# Altium schematic sheet Autoreset.SchDoc
size A4; SheetNumber: 10; SheetTotal: 12
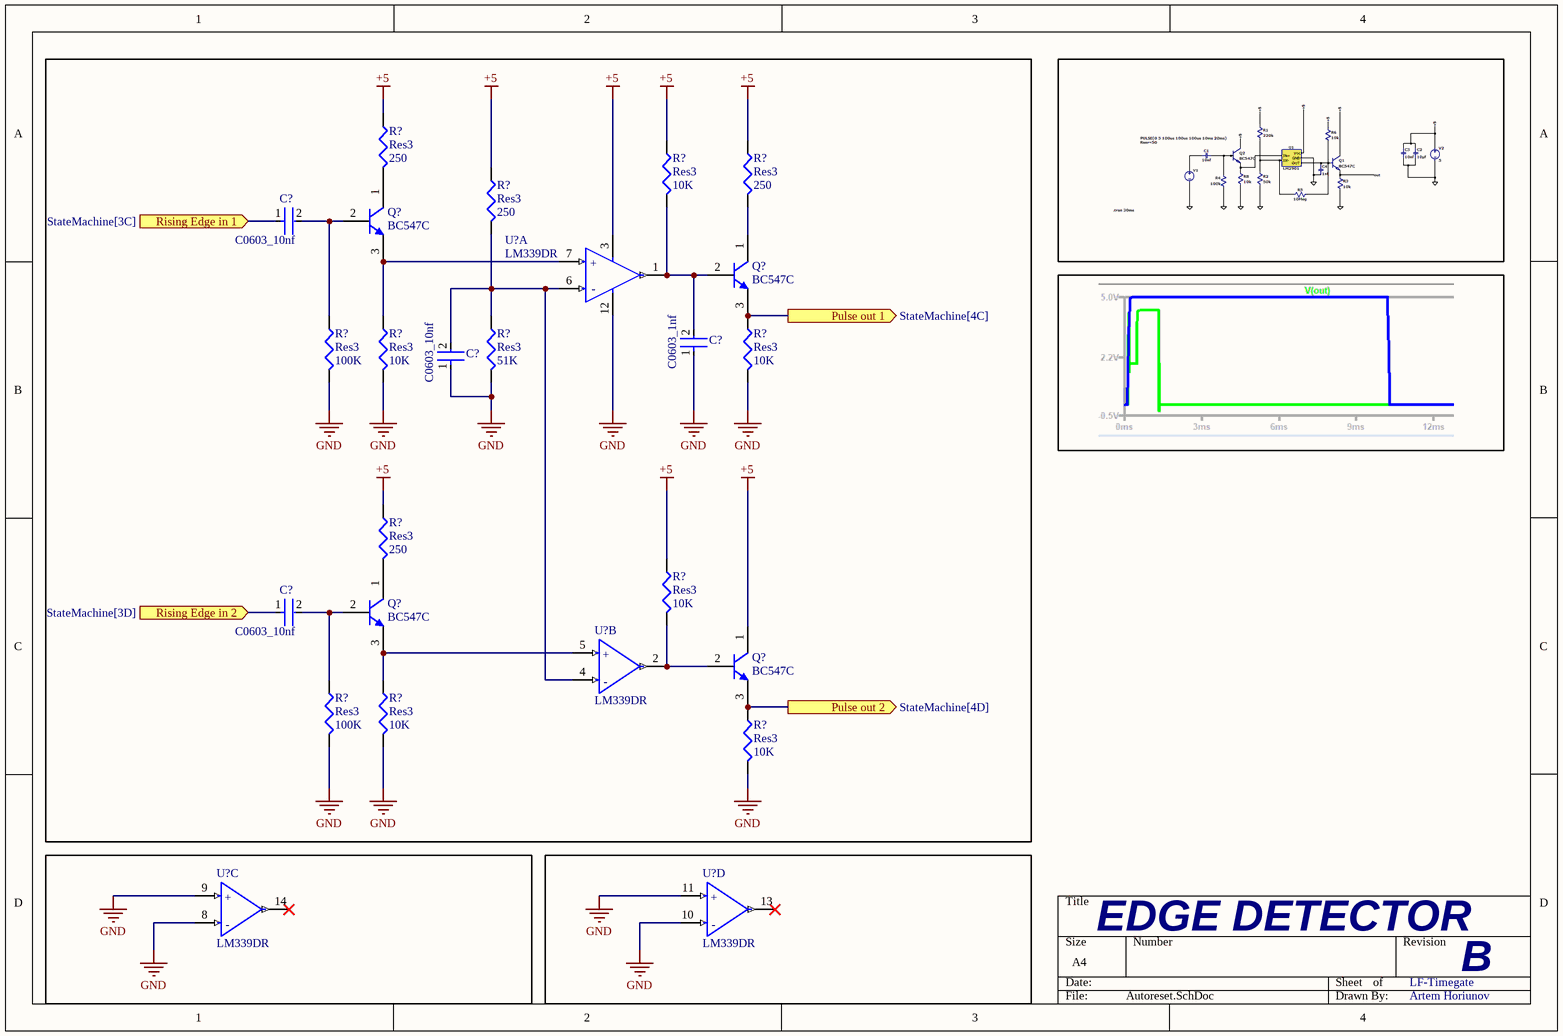
[diagram p0: Autoreset.SchDoc]

## Parts
(Parts that share a designator on the sheet are numbered #1, #2 ... from top to bottom, then left to right.)
C?#1  C0603_10nf  [FP-C0603C-CF-MFG]
C?#2  C0603_1nf  [FP-C0603C-CF-MFG]
C?#3  C0603_10nf  [FP-C0603C-CF-MFG]
C?#4  C0603_10nf  [FP-C0603C-CF-MFG]
Q?#1  BC547C  [ONSC-TO-92-3-29-11]
Q?#2  BC547C  [ONSC-TO-92-3-29-11]
Q?#3  BC547C  [ONSC-TO-92-3-29-11]
Q?#4  BC547C  [ONSC-TO-92-3-29-11]
R?#1  Res3  value 250  [J1-0603]
R?#2  Res3  value 10K  [J1-0603]
R?#3  Res3  value 250  [J1-0603]
R?#4  Res3  value 250  [J1-0603]
R?#5  Res3  value 100K  [J1-0603]
R?#6  Res3  value 10K  [J1-0603]
R?#7  Res3  value 51K  [J1-0603]
R?#8  Res3  value 10K  [J1-0603]
R?#9  Res3  value 250  [J1-0603]
R?#10  Res3  value 10K  [J1-0603]
R?#11  Res3  value 100K  [J1-0603]
R?#12  Res3  value 10K  [J1-0603]
R?#13  Res3  value 10K  [J1-0603]
U?#1  LM339DR  [FP-D0014A-MFG]  (part A of 4)
U?#2  LM339DR  [FP-D0014A-MFG]  (part B of 4)
U?#3  LM339DR  [FP-D0014A-MFG]  (part C of 4)
U?#4  LM339DR  [FP-D0014A-MFG]  (part D of 4)

## Ports
Pulse out 1 (out, see StateMachine[4C]), Pulse out 2 (out, see StateMachine[4D]), Rising Edge in 1 (in, see StateMachine[3C]), Rising Edge in 2 (in, see StateMachine[3D])

## Nets
+5: Q?#4.1(C) R?#1.1 R?#2.1 R?#3.1 R?#4.1 R?#9.1 R?#10.1 U?#1.3(VCC)
GND: C?#2.1 C?#3.1 R?#5.2 R?#6.2 R?#7.2 R?#8.2 R?#11.2 R?#12.2 R?#13.2 U?#1.12(GND) U?#3.8(3IN-) U?#3.9(3IN+) U?#4.10(4IN-) U?#4.11(4IN+)
Pulse out 1: Q?#2.3(E) R?#8.1 ; port Pulse out 1
Pulse out 2: Q?#4.3(E) R?#13.1 ; port Pulse out 2
Rising Edge in 1: C?#1.1 ; port Rising Edge in 1
Rising Edge in 2: C?#4.1 ; port Rising Edge in 2
NetC?#1_2: C?#1.2 Q?#1.2(B) R?#5.1
NetC?#2_2: C?#2.2 Q?#2.2(B) R?#2.2 U?#1.1(1OUT)
NetC?#3_2: C?#3.2 R?#4.2 R?#7.1 U?#1.6(1IN-) U?#2.4(2IN-)
NetC?#4_2: C?#4.2 Q?#3.2(B) R?#11.1
NetQ?#1_1: Q?#1.1(C) R?#1.2
NetQ?#1_3: Q?#1.3(E) R?#6.1 U?#1.7(1IN+)
NetQ?#2_1: Q?#2.1(C) R?#3.2
NetQ?#3_1: Q?#3.1(C) R?#9.2
NetQ?#3_3: Q?#3.3(E) R?#12.1 U?#2.5(2IN+)
NetQ?#4_2: Q?#4.2(B) R?#10.2 U?#2.2(2OUT)

Not connected (* = marked no-connect by the designer): U?#3 14(OUT3)*; U?#4 13(OUT4)*

## Notes on the sheet
- EDGE DETECTOR
- LF-Timegate
- B
- Artem Horiunov
- (in symbol CMP-04896-000028-1, part A) +; -
- (in symbol CMP-04896-000028-1, part B) +; -
- (in symbol CMP-04896-000028-1, part C) +; -
- (in symbol CMP-04896-000028-1, part D) +; -

## Library data of the parts
C?#1-C?#4 = CMP-1035-00914-3: CAP CER 30PF 50V 5% NP0 0603; Manufacturer Part Number: C0603C300J5GACTU; Manufacturer: KEMET; Automotive Grade: Grade 1; Temperature Coefficient: 30ppm/°C; Material: Ceramic; Temperature Characteristic: C0G; Tolerance: 0.05; ComponentLink2URL: https://api.kemet.com/component-edge/download/datasheet/C0603C100J5GACAUTO.pdf; Automotive: Yes; Device Class L2: Capacitors; Device Class L1: Passive Components; Device Class L3: Ceramic Capacitors; RoHS: TRUE; Octopart: https://octopart.com/c0603c300j5gactu-kemet-199455; Lead Free: Yes; Value: 30 pF; Temperature Range High: +125°C; Category: Cap; Temperature: -55°C to +125°C; Package: C0603C-CF; Capacitance: 30 pF; Digikey Description: CAP CER 30PF 50V 5% NP0 0603; Height: 0.87mm; ComponentLink2Description: Datasheet; Temperature Range Low: -55°C; Mouser Description: Multilayer Ceramic Capacitors MLCC - SMD/SMT 50volts 30pF C0G 5%; Voltage Rating: 50 V
Q?#1-Q?#4 = CMP-1048-01437-1: Amplifier Transistor, NPN Silicon, 3-Pin TO-92, Bulk Box; Manufacturer: On Semiconductor; IC Continuous (A): 0.1; fT Min (MHz): 150; Mounting Technology: Through Hole; ComponentLink1URL: http://www.onsemi.com/; ComponentLink1Description: Manufacturer URL; ComponentLink3URL: http://www.onsemi.cn/pub_link/Collateral/2N6426-D.PDF; DatasheetVersion: Rev. 7; PackageVersion: Rev. AM; Packing: Bulk Box; RoHS: FALSE; Polarity: NPN; PartNumber: BC547C; ComponentLink2URL: http://www.onsemi.com/pub_link/Collateral/BC546-D.PDF; ComponentLink3Description: Package Specification; PackageDescription: 3-Pin Transistor Outline, Body 4.825 x 3.685 mm, Pitch 1.27 mm; PackageReference: TO-92-3-29-11_AM_SL; ComponentLink2Description: Datasheet
R?#1-R?#13 = Res3: Resistor; Published: 8-Jun-2000; LatestRevisionDate: 29-May-2009; LatestRevisionNote: IPC-7351 Footprint Added.; PackageReference: J1-0603; Publisher: Altium Limited; PackageDescription: Chip Resistor
U?#1-U?#4 = CMP-04896-000028-1: IC QUAD DIFF COMP 14-SOIC; Manufacturer: Texas Instruments; Nominal Supply Current: 0.8mA; Min Dual Supply Voltage: 1V; Number Of Channels: 4; Input Offset Voltage: 2mV; Max Junction Temp: +70°C; Min Supply Voltage: 2V; Response Time: 1.3us; Max Dual Supply Voltage: 18V; Max Supply Voltage: 30V; Standoff Height: 0.1mm; Input Bias Current: -0.025uA; Output Current Per Channel: 6mA; Category: IC; Octopart: https://octopart.com/lm339dr-texas+instruments-45532; Automotive: No; Temperature: 0°C to +70°C; Ipc Land Pattern Name: SOIC127P600X175-14; Temperature Range Low: 0°C; Mouser Description: Analog Comparators Quad Differential; Lead Free: Yes; Digikey Description: IC QUAD DIFF COMP 14-SOIC; ComponentLink2URL: http://www.ti.com/lit/ds/symlink/lm339.pdf; Device Class L3: Comparators; Manufacturer Part Number: LM339DR; Temperature Range High: +70°C; Device Class L2: Linear ICs; Height: 1.75mm; Device Class L1: Integrated Circuits (ICs); Package: D0014A; RoHS: TRUE; ComponentLink2Description: Datasheet